# EAGLE design logicBlocks-Battery (EAGLE 6.2)
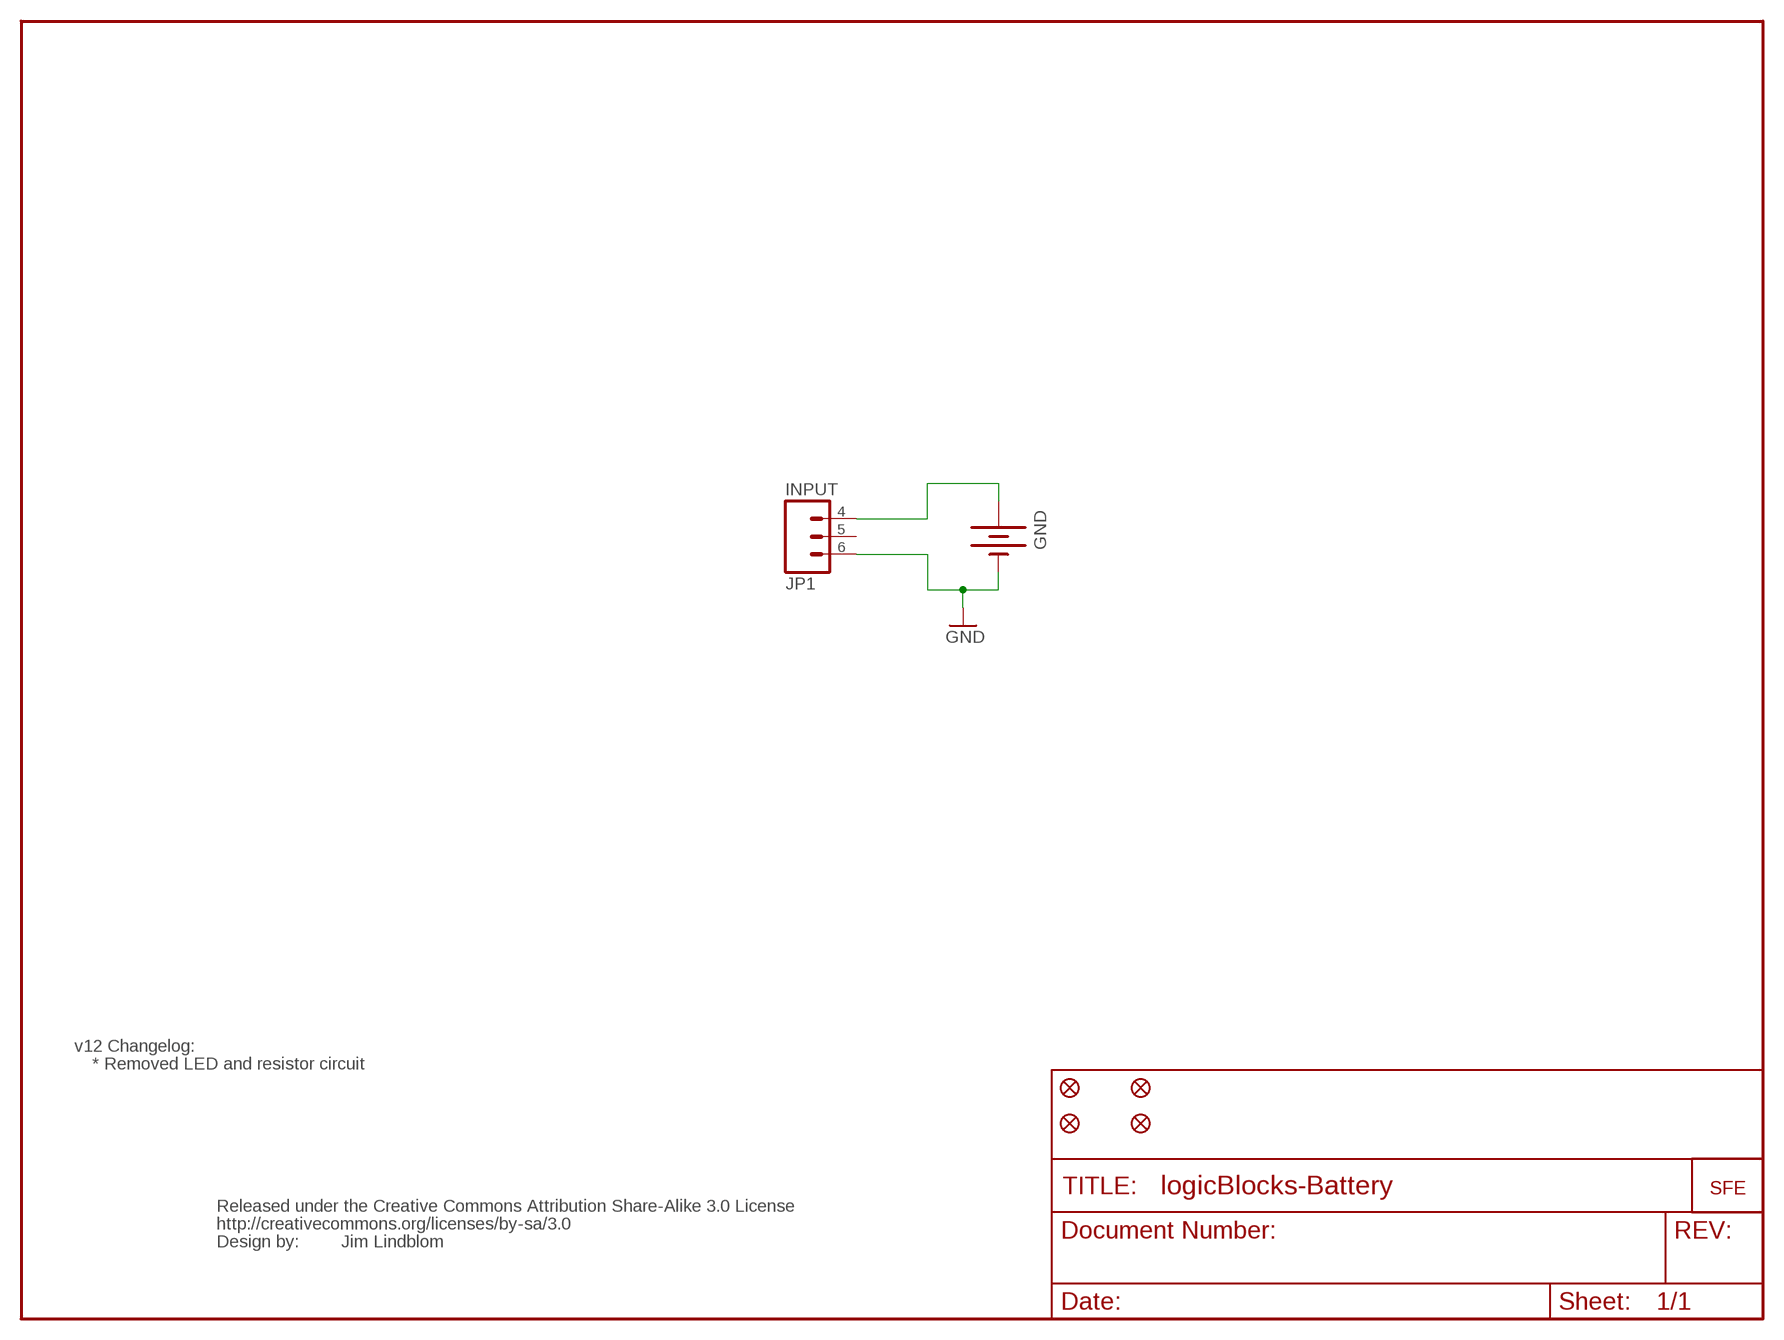
[diagram p0: schematic, sheet 1]

## Parts
GND  BATTERY20MM_4LEGS  [BATTCON_20MM_4LEGS]
JP1  INPUT  M03SMD-RA-FEMALE  [1X03-SMD-FEMALE]
JP3  LOGO-SFESK  [SFE-LOGO-FLAME]
JP4  FIDUCIALUFIDUCIAL  [MICRO-FIDUCIAL]
JP5  FIDUCIALUFIDUCIAL  [MICRO-FIDUCIAL]
JP6  FIDUCIALUFIDUCIAL  [MICRO-FIDUCIAL]
JP7  FIDUCIALUFIDUCIAL  [MICRO-FIDUCIAL]
U$2  CREATIVE_COMMONS  [CREATIVE_COMMONS]

## Nets
GND: GND.2(-) JP1.6
VCC: GND.1(+) JP1.4
Unconnected: JP1.5

## Notes on the sheet
- v12 Changelog:
- * Removed LED and resistor circuit
- Jim Lindblom

## Library data of the parts
GND = SparkFun:BATTERY: Battery Holders Various common sizes : AA, AAA, 20mm coin cell and 12mm coin cell.
JP1 = SparkFun:M03: Header 3 Standard 3-pin 0.1" header. Use with straight break away headers (SKU : PRT-00116), right angle break away headers (PRT-00553), swiss pins (PRT-00743), machine pins (PRT-00117), and female headers (PRT-00115). Molex polarized connector foot print use with SKU : PRT-08232 with associated crimp pins and housings.
JP3 = SparkFun:LOGO-SFE: Spark Fun Electronics PCB Logo This is the standard Spark Fun Electronics PCB logo.
JP4-JP7 = SparkFun:FIDUCIAL: Fiducial Alignment Points Various fiducial points for machine vision alignment.
U$2 = SparkFun:CREATIVE_COMMONS

## Board
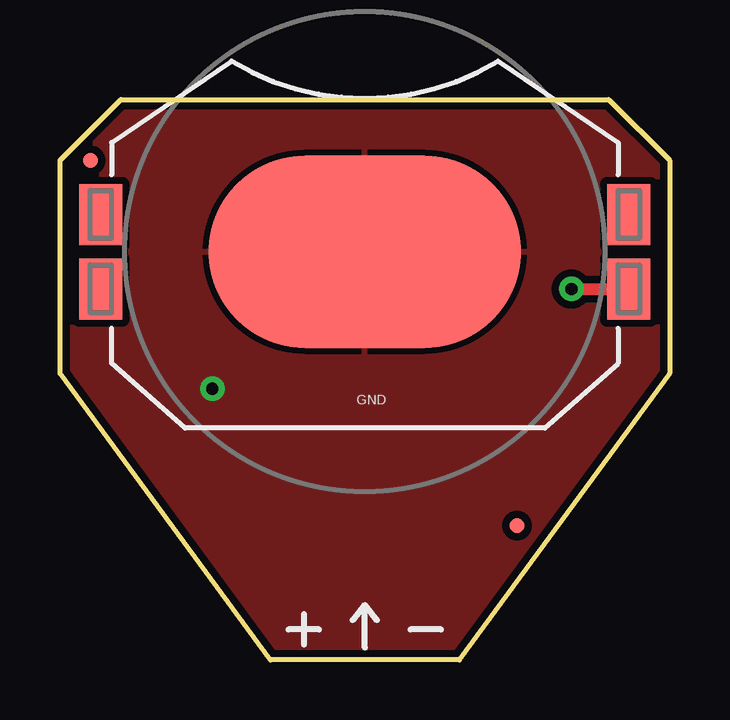
[diagram p1: board, top side]
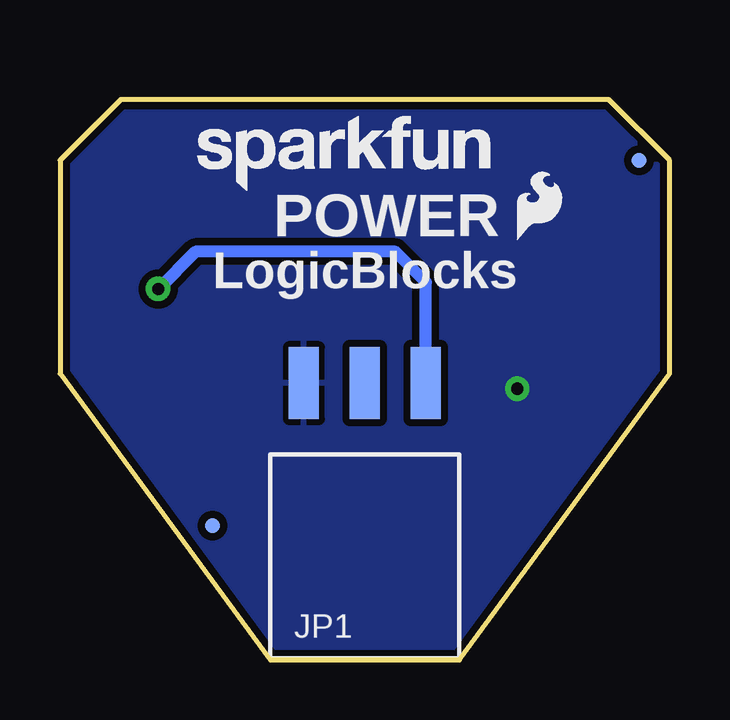
[diagram p2: board, bottom side, seen from below]

Size 25.4 x 23.37 mm. Coordinates in mm from the lower left corner, seen from the top.
Outline: 8.76,0 0,11.94 0,20.83 2.54,23.37 22.86,23.37 25.4,20.83 25.4,11.94 16.64,0 8.76,0
Copper layers (1*16): Top 0.035mm / dielectric 1.5mm / Bottom 0.035mm
Design rules: minimum track width 8mil, minimum drill 20mil, track to track 8mil, track to pad 8mil, pad to pad 8mil, via to via 8mil, smd to smd 8mil, copper to edge 8mil, drill to drill 8mil, minimum pad ring 12mil, minimum via ring 10mil, stop-mask expansion 4mil, vias tented up to drill 20mil, thermal gap 10mil

### Footprints (pad centres in the part's own frame; a part is rotated, then mirrored left to right if it is on the bottom)
BATTCON_20MM_4LEGS = smd 1.778 x 2.54: 1 -11,1.55; 3 11,1.55; P$1 -11,-1.55; P$2 11,-1.55 | smd 13 x 8: 2 0,0
1X03-SMD-FEMALE = smd 1.25 x 3: 4 2.54,7.225; 5 0,7.225; 6 -2.54,7.225
MICRO-FIDUCIAL = smd 0.635 x 0.635: 1 0,0

### Placement (x,y rotation side)
GND  12.7,17.02 180 top
JP1  12.7,4.32 0 bottom
JP2  LOGO-SFENW2  [SFE-NEW-WEB]  19.68,19.56 0 bottom
JP3  6.35,17.53 0 bottom
JP4  19.05,5.59 0 bottom
JP5  1.27,20.83 0 bottom
JP6  1.27,20.83 0 top
JP7  19.05,5.59 0 top
U$2  0,-3.3 0 top  (outside the outline)

### Tracks (layer width: path | path; a pad name or v marks a point on that pad's centre or on a via)
GND  (via drill 0.51)
  other vias: 6.35,11.3
  pour Top (isolate 0.305): 8.76,0 0,11.94 0,20.83 2.54,23.37 22.86,23.37 25.4,20.83 25.4,11.94 16.64,0
  pour Bottom (isolate 0.305): 8.76,0 0,11.94 0,20.83 2.54,23.37 22.86,23.37 25.4,20.83 25.4,11.94 16.64,0
VCC  (via drill 0.51)
  Top 0.508: v21.31,15.47 GND.1
  Bottom 0.508: JP1.4 10.16,15.75 11.43,17.02 19.76,17.02 v21.31,15.47

### Text on the board
bPlace: POWER | LogicBlocks